# EAGLE schematic EFM_VCF_4622 (EAGLE 7.2.0)
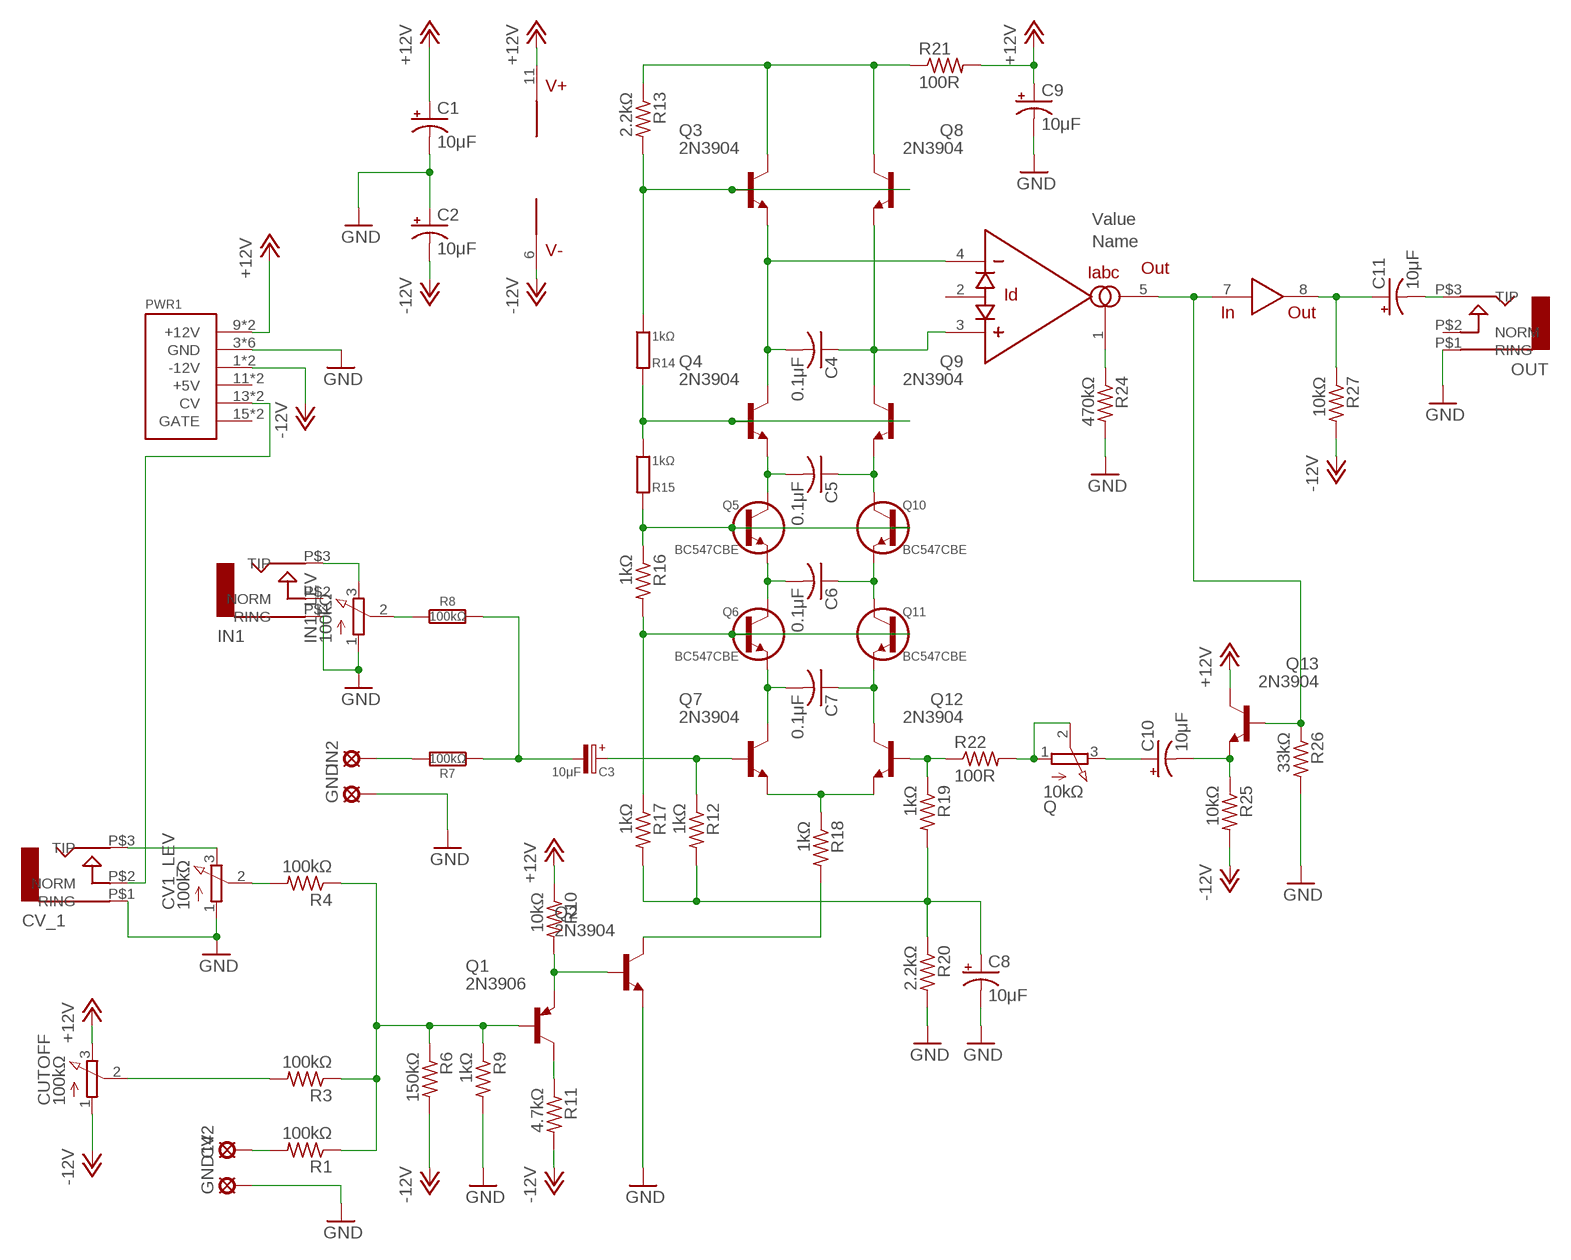
[diagram p0: schematic, sheet 1]

## Parts
C1  10μF  CPOL-USB45181A  [B45181A]
C2  10μF  CPOL-USB45181A  [B45181A]
C3  10μF  CPOL-HE2,5-4  [E2,5-4]
C4  0.1μF  C-US050-025X075  [C050-025X075]
C5  0.1μF  C-US050-025X075  [C050-025X075]
C6  0.1μF  C-US050-025X075  [C050-025X075]
C7  0.1μF  C-US050-025X075  [C050-025X075]
C8  10μF  CPOL-USB45181A  [B45181A]
C9  10μF  CPOL-USB45181A  [B45181A]
C10  10μF  CPOL-USB45181C  [B45181C]
C11  10μF  CPOL-USB45181B  [B45181B]
CUTOFF  100kΩ  3RP/1610N  [3RP/1610N]
CV1_LEV  100kΩ  3RP/1610N  [3RP/1610N]
CV2  LSP10  [LSP10]
CV_1  AUDIO-JACK  [ERTHENVAR-JACK-90DEG]
GND  LSP10  [LSP10]
GND14  LSP10  [LSP10]
IC1  LM13700N  [DIL16]
IN1  AUDIO-JACK  [ERTHENVAR-JACK-90DEG]
IN1_LEV  100kΩ  3RP/1610N  [3RP/1610N]
IN2  LSP10  [LSP10]
OUT  AUDIO-JACK  [ERTHENVAR-JACK-90DEG]
PWR1  POWER  [POWER_16]
Q  10kΩ  3RP/1610N  [3RP/1610N]
Q1  2N3906  [TO92]
Q2  2N3904  [TO92]
Q3  2N3904  [TO92]
Q4  2N3904  [TO92]
Q5  BC547CBE  [TO92-CBE]
Q6  BC547CBE  [TO92-CBE]
Q7  2N3904  [TO92]
Q8  2N3904  [TO92]
Q9  2N3904  [TO92]
Q10  BC547CBE  [TO92-CBE]
Q11  BC547CBE  [TO92-CBE]
Q12  2N3904  [TO92]
Q13  2N3904  [TO92]
R1  100kΩ  R-US_0207/7  [0207/7]
R3  100kΩ  R-US_0207/7  [0207/7]
R4  100kΩ  R-US_0207/7  [0207/7]
R6  150kΩ  R-US_0207/7  [0207/7]
R7  100kΩ  R-H0204/10  [0204/10]
R8  100kΩ  R-H0204/10  [0204/10]
R9  1kΩ  R-US_0207/7  [0207/7]
R10  10kΩ  R-US_0207/7  [0207/7]
R11  4.7kΩ  R-US_0207/7  [0207/7]
R12  1kΩ  R-US_0207/7  [0207/7]
R13  2.2kΩ  R-US_0207/7  [0207/7]
R14  1kΩ  R0204/10-V  [0204/10-V]
R15  1kΩ  R0204/10-V  [0204/10-V]
R16  1kΩ  R-US_0207/7  [0207/7]
R17  1kΩ  R-US_0207/7  [0207/7]
R18  1kΩ  R-US_0207/7  [0207/7]
R19  1kΩ  R-US_0207/7  [0207/7]
R20  2.2kΩ  R-US_0207/7  [0207/7]
R21  100R  R-US_0207/7  [0207/7]
R22  100R  R-US_0207/7  [0207/7]
R24  470kΩ  R-US_0207/7  [0207/7]
R25  10kΩ  R-US_0207/7  [0207/7]
R26  33kΩ  R-US_0207/7  [0207/7]
R27  10kΩ  R-US_0207/7  [0207/7]

## Nets
+12V: C1.+ C9.+ CUTOFF.3(E) IC1.11(V+) PWR1.9(+12V) PWR1.10(+12V) Q13.1(C) R10.1 R21.2
-12V: C2.- CUTOFF.1(A) IC1.6(V-) PWR1.1(-12V) PWR1.2(-12V) R6.2 R11.2 R25.2 R27.2
GND: C1.- C2.+ C8.- C9.- CV1_LEV.1(A) CV_1.P$1(RING) GND14.MP GND.MP IN1.P$1(RING) IN1_LEV.1(A) OUT.P$1(RING) PWR1.3(GND) PWR1.4(GND) PWR1.5(GND) PWR1.6(GND) PWR1.7(GND) PWR1.8(GND) Q2.3(E) R9.2 R20.2 R24.2 R26.2
N$1: IC1.1(A:IABC) R24.1
N$2: Q.1(A) Q.2(S) R22.2
N$3: Q2.1(C) R18.2
N$4: Q7.3(E) Q12.3(E) R18.1
N$5: IN2.MP R7.2
N$6: C3.- R7.1 R8.2
N$7: C3.+ Q7.2(B) R12.1
N$8: Q1.3(E) Q2.2(B) R10.2
N$9: C4.2 IC1.4(A:-IN) Q3.3(E) Q4.1(C)
N$10: C10.+ Q.3(E)
N$11: CV2.MP R1.2
N$12: C4.1 IC1.3(A:+IN) Q8.3(E) Q9.1(C)
N$13: C6.1 Q10.E Q11.C
N$14: C5.2 Q4.3(E) Q5.C
N$15: C5.1 Q9.3(E) Q10.C
N$17: C7.1 Q11.E Q12.1(C)
N$18: C7.2 Q6.E Q7.1(C)
N$19: IC1.5(A:OUT) IC1.7(IN) Q13.2(B) R26.1
N$20: Q1.2(B) R1.1 R3.1 R4.1 R6.1 R9.1
N$25: C8.+ R12.2 R17.2 R19.2 R20.1
N$26: Q12.2(B) R19.1 R22.1
N$27: Q1.1(C) R11.1
N$28: C11.+ IC1.8(OUT) R27.1
N$29: C6.2 Q5.E Q6.C
N$31: C11.- OUT.P$3(TIP)
N$35: C10.- Q13.3(E) R25.1
N$43: Q3.1(C) Q8.1(C) R13.1 R21.1
N$44: Q3.2(B) Q8.2(B) R13.2 R14.2
N$46: Q4.2(B) Q9.2(B) R14.1 R15.2
N$49: Q5.B Q10.B R15.1 R16.1
N$50: Q6.B Q11.B R16.2 R17.1
N$53: CV1_LEV.2(S) R4.2
N$55: CV_1.P$2(NORM) PWR1.13(CV) PWR1.14(CV)
N$56: CUTOFF.2(S) R3.2
N$57: IN1_LEV.2(S) R8.1
N$58: IN1.P$3(TIP) IN1_LEV.3(E)
N$59: CV1_LEV.3(E) CV_1.P$3(TIP)
Unconnected: IC1.2(A:ID) IC1.9(OUT) IC1.10(IN) IC1.12(B:OUT) IC1.13(B:-IN) IC1.14(B:+IN) IC1.15(B:ID) IC1.16(B:IABC) IN1.P$2(NORM) OUT.P$2(NORM) PWR1.11(+5V) PWR1.12(+5V) PWR1.15(GATE) PWR1.16(GATE)

## Library data of the parts
C1 C2 C8-C11 = rcl:CPOL-US: POLARIZED CAPACITOR, American symbol
C3 = c:CPOL-H
C4-C7 = rcl:C-US: CAPACITOR, American symbol
CUTOFF CV1_LEV IN1_LEV Q = pot:3RP/1610N: 16mm Potentiometer one level Source: http://www.alphapotentiometers.net/html/16mm_pot_2.html
CV2 GND GND14 IN2 = solpad:LSP10: SOLDER PAD drill 1.0 mm, distributor Buerklin, 12H555
CV_1 IN1 OUT = erthenvar:AUDIO-JACK: Switching Mono 3.5mm Audio Jack from Erthenvar.
IC1 = synthdiy updated imperial:LM13700: National Dual OTA with buffers.
PWR1 = eurorack:POWER
Q1 = transistor-pnp:2N3906: PNP Transistor
Q2-Q4 Q7-Q9 Q12 Q13 = transistor-npn:2N3904: NPN Transistor
Q5 Q6 Q10 Q11 = t:BC547
R1 R3 R4 R6 R9-R13 R16-R22 R24-R27 = rcl:R-US_: RESISTOR, American symbol
R7 R8 = r:R-H
R14 R15 = r:R: RESISTOR, European symbol